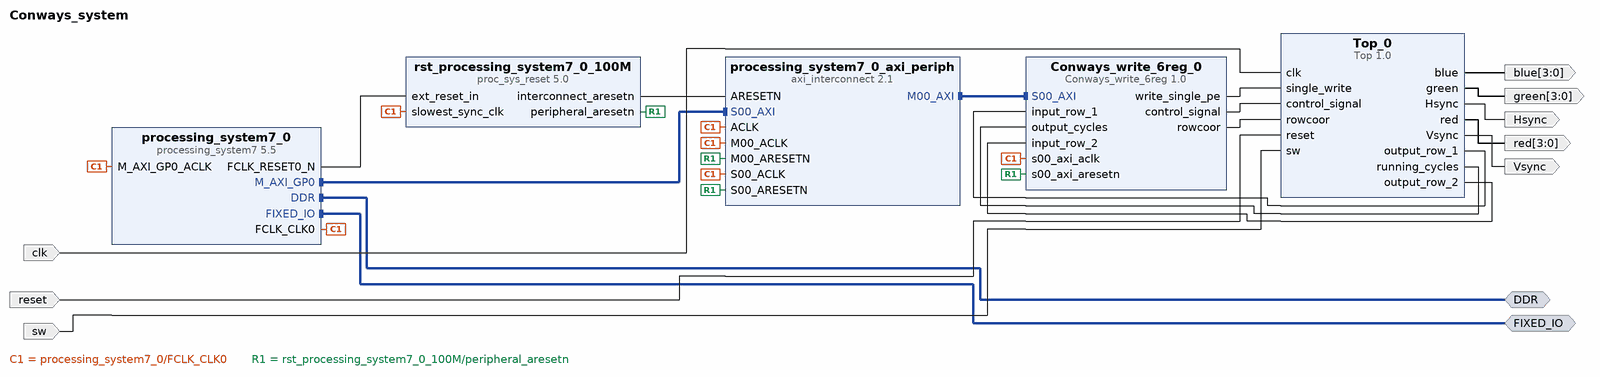
[diagram p0: block diagram of the top level]
# Vivado block design Conways_system, Vivado 2016.2
create_bd_design Conways_system

create_bd_intf_port -mode Master -vlnv xilinx.com:interface:ddrx_rtl:1.0 DDR
create_bd_intf_port -mode Master -vlnv xilinx.com:display_processing_system7:fixedio_rtl:1.0 FIXED_IO
create_bd_port -dir I clk
create_bd_port -dir O -from 3 -to 0 red
create_bd_port -dir O -from 3 -to 0 green
create_bd_port -dir O -from 3 -to 0 blue
create_bd_port -dir O Hsync
create_bd_port -dir I reset
create_bd_port -dir I sw
create_bd_port -dir O Vsync

create_bd_cell -type ip -vlnv xilinx.com:ip:processing_system7:5.5 processing_system7_0
set_property -dict {CONFIG.preset ZedBoard} [get_bd_cells processing_system7_0]
create_bd_cell -type ip -vlnv xilinx.com:ip:proc_sys_reset:5.0 rst_processing_system7_0_100M
create_bd_cell -type ip -vlnv xilinx.com:ip:axi_interconnect:2.1 processing_system7_0_axi_periph
set_property -dict {CONFIG.NUM_MI 1} [get_bd_cells processing_system7_0_axi_periph]
create_bd_cell -type ip -vlnv LAFAYETTE:user:Conways_write_6reg:1.0 Conways_write_6reg_0
create_bd_cell -type ip -vlnv LAFAYETTE:user:Top:1.0 Top_0

# ---- connections ----

connect_bd_intf_net [get_bd_intf_pins processing_system7_0/M_AXI_GP0] [get_bd_intf_pins processing_system7_0_axi_periph/S00_AXI]
connect_bd_intf_net [get_bd_intf_pins processing_system7_0_axi_periph/M00_AXI] [get_bd_intf_pins Conways_write_6reg_0/S00_AXI]
connect_bd_intf_net [get_bd_intf_ports DDR] [get_bd_intf_pins processing_system7_0/DDR]
connect_bd_intf_net [get_bd_intf_ports FIXED_IO] [get_bd_intf_pins processing_system7_0/FIXED_IO]
connect_bd_net [get_bd_pins processing_system7_0/FCLK_CLK0] \
  [get_bd_pins processing_system7_0/M_AXI_GP0_ACLK] [get_bd_pins rst_processing_system7_0_100M/slowest_sync_clk] \
  [get_bd_pins processing_system7_0_axi_periph/S00_ACLK] [get_bd_pins processing_system7_0_axi_periph/ACLK] \
  [get_bd_pins processing_system7_0_axi_periph/M00_ACLK] [get_bd_pins Conways_write_6reg_0/s00_axi_aclk]
connect_bd_net [get_bd_pins processing_system7_0/FCLK_RESET0_N] [get_bd_pins rst_processing_system7_0_100M/ext_reset_in]
connect_bd_net [get_bd_ports clk] [get_bd_pins Top_0/clk]
connect_bd_net [get_bd_pins Top_0/red] [get_bd_ports red]
connect_bd_net [get_bd_pins Top_0/green] [get_bd_ports green]
connect_bd_net [get_bd_pins Top_0/blue] [get_bd_ports blue]
connect_bd_net [get_bd_pins Top_0/Hsync] [get_bd_ports Hsync]
connect_bd_net [get_bd_ports reset] [get_bd_pins Top_0/reset]
connect_bd_net [get_bd_ports sw] [get_bd_pins Top_0/sw]
connect_bd_net [get_bd_pins Top_0/Vsync] [get_bd_ports Vsync]
connect_bd_net [get_bd_pins rst_processing_system7_0_100M/peripheral_aresetn] \
  [get_bd_pins processing_system7_0_axi_periph/S00_ARESETN] [get_bd_pins processing_system7_0_axi_periph/M00_ARESETN] \
  [get_bd_pins Conways_write_6reg_0/s00_axi_aresetn]
connect_bd_net [get_bd_pins rst_processing_system7_0_100M/interconnect_aresetn] [get_bd_pins processing_system7_0_axi_periph/ARESETN]
connect_bd_net [get_bd_pins Conways_write_6reg_0/write_single_pe] [get_bd_pins Top_0/single_write]
connect_bd_net [get_bd_pins Conways_write_6reg_0/control_signal] [get_bd_pins Top_0/control_signal]
connect_bd_net [get_bd_pins Conways_write_6reg_0/rowcoor] [get_bd_pins Top_0/rowcoor]
connect_bd_net [get_bd_pins Top_0/output_row_1] [get_bd_pins Conways_write_6reg_0/input_row_1]
connect_bd_net [get_bd_pins Top_0/running_cycles] [get_bd_pins Conways_write_6reg_0/output_cycles]
connect_bd_net [get_bd_pins Top_0/output_row_2] [get_bd_pins Conways_write_6reg_0/input_row_2]

# ---- address map ----
assign_bd_address -offset 0x43C00000 -range 64K -target_address_space [get_bd_addr_spaces processing_system7_0/Data] [get_bd_addr_segs Conways_write_6reg_0/S00_AXI/S00_AXI_reg]

validate_bd_design
save_bd_design
